# EasyEDA schematic SCH.json
TITLE: 8 Bit R-2R DAC; REV: 1.0; Date: 2023-07-31; Sheet: 1/1; Drawn By: Ella Pash
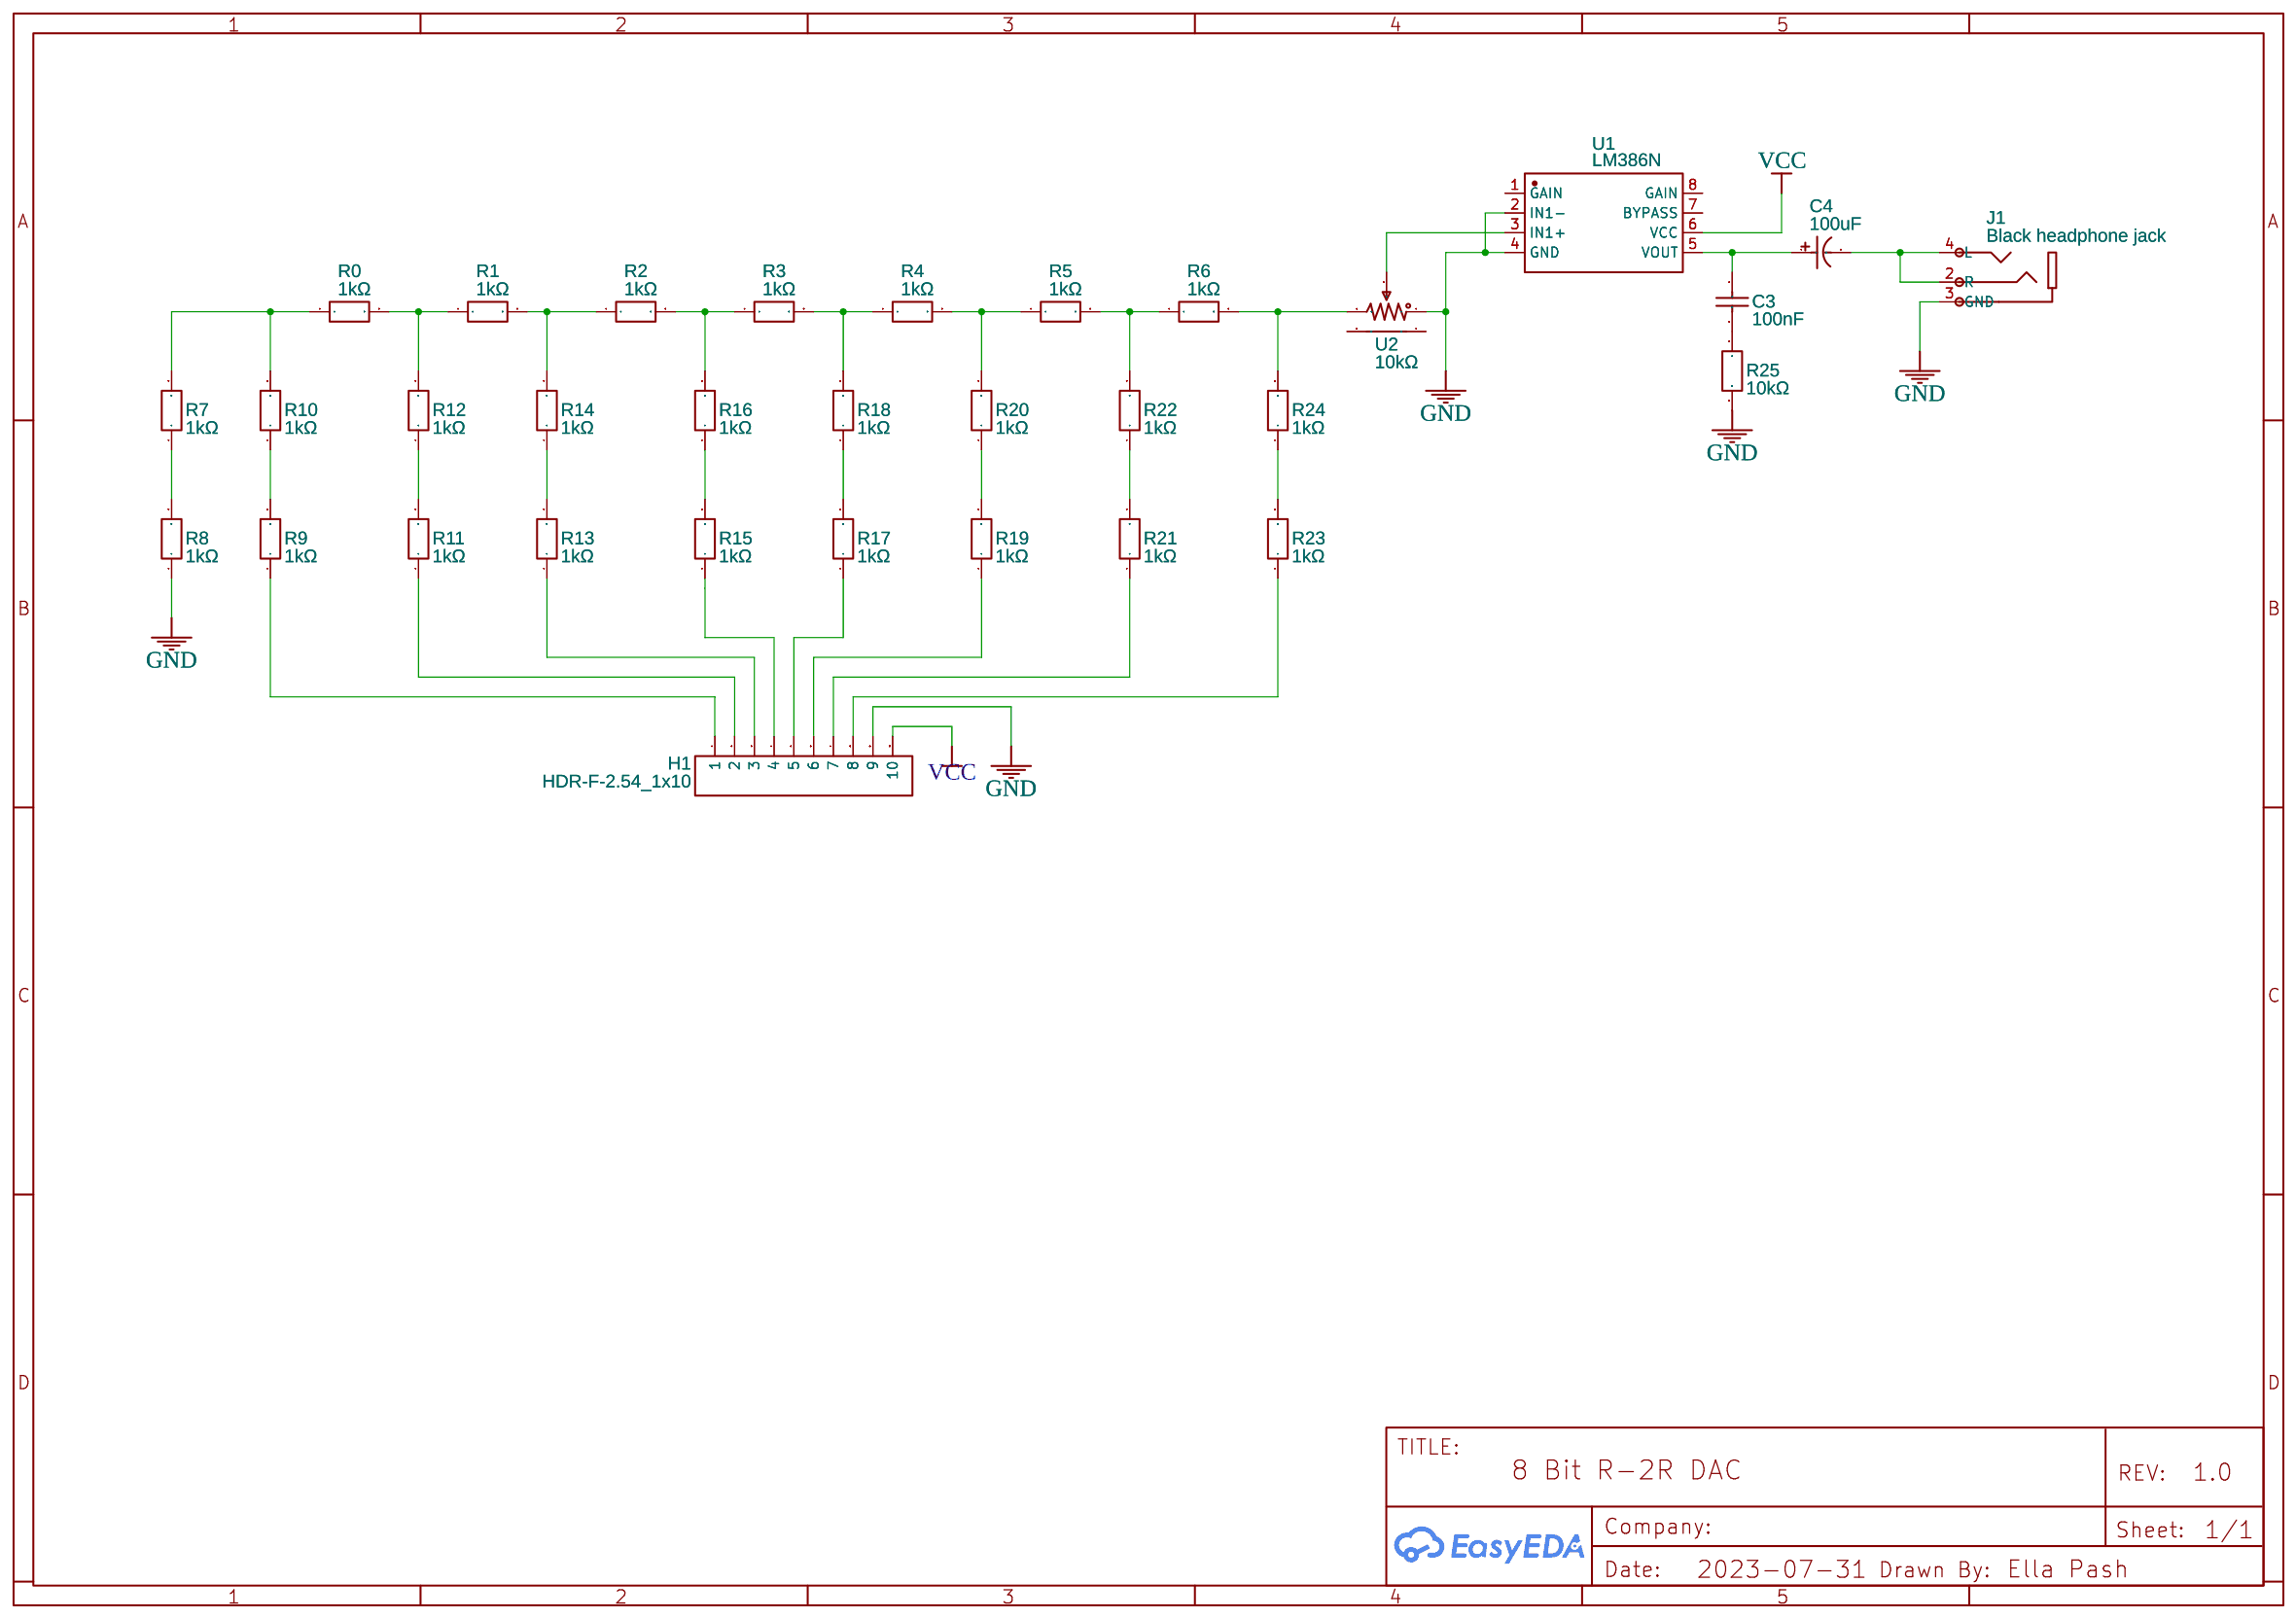
[diagram p0: schematic sheet]

## Parts
C3  100nF  [CAP-TH_L5.0-W3.2-P5.00-D0.5]
C4  100uF  [CAP-TH_BD5.0-P2.00-D0.8-FD]
H1  HDR-F-2.54_1x10  [HDR-F-2.54_1X10]
J1  Black headphone jack  [AUDIO-TH_PJ-3200]
R0  1kΩ  [RES-TH_BD2.3-L6.5-P10.50-D0.5]
R1  1kΩ  [RES-TH_BD2.3-L6.5-P10.50-D0.5]
R2  1kΩ  [RES-TH_BD2.3-L6.5-P10.50-D0.5]
R3  1kΩ  [RES-TH_BD2.3-L6.5-P10.50-D0.5]
R4  1kΩ  [RES-TH_BD2.3-L6.5-P10.50-D0.5]
R5  1kΩ  [RES-TH_BD2.3-L6.5-P10.50-D0.5]
R6  1kΩ  [RES-TH_BD2.3-L6.5-P10.50-D0.5]
R7  1kΩ  [RES-TH_BD2.3-L6.5-P10.50-D0.5]
R8  1kΩ  [RES-TH_BD2.3-L6.5-P10.50-D0.5]
R9  1kΩ  [RES-TH_BD2.3-L6.5-P10.50-D0.5]
R10  1kΩ  [RES-TH_BD2.3-L6.5-P10.50-D0.5]
R11  1kΩ  [RES-TH_BD2.3-L6.5-P10.50-D0.5]
R12  1kΩ  [RES-TH_BD2.3-L6.5-P10.50-D0.5]
R13  1kΩ  [RES-TH_BD2.3-L6.5-P10.50-D0.5]
R14  1kΩ  [RES-TH_BD2.3-L6.5-P10.50-D0.5]
R15  1kΩ  [RES-TH_BD2.3-L6.5-P10.50-D0.5]
R16  1kΩ  [RES-TH_BD2.3-L6.5-P10.50-D0.5]
R17  1kΩ  [RES-TH_BD2.3-L6.5-P10.50-D0.5]
R18  1kΩ  [RES-TH_BD2.3-L6.5-P10.50-D0.5]
R19  1kΩ  [RES-TH_BD2.3-L6.5-P10.50-D0.5]
R20  1kΩ  [RES-TH_BD2.3-L6.5-P10.50-D0.5]
R21  1kΩ  [RES-TH_BD2.3-L6.5-P10.50-D0.5]
R22  1kΩ  [RES-TH_BD2.3-L6.5-P10.50-D0.5]
R23  1kΩ  [RES-TH_BD2.3-L6.5-P10.50-D0.5]
R24  1kΩ  [RES-TH_BD2.3-L6.5-P10.50-D0.5]
R25  10kΩ  [RES-TH_BD2.4-L6.3-P10.30-D0.6]
U1  LM386N  [DIP-8_L9.7-W6.4-P2.54-LS7.6-BL]
U2  10kΩ  [RES-TH_RK09D1130C2P]

## Library data of the parts
C3 = K104K20X7RH53H5: Contributor: LCSC; Supplier: LCSC; Supplier Part: C1620208; Manufacturer: VISHAY(威世); JLCPCB Part Class: Extended Part; link: https://lcsc.com/eda_search?q=C1620208&%26type=1&ref=editor
C4 = 100uF 25V 5*11: Supplier: LCSC; Manufacturer: CX(承兴); Manufacturer Part: KM107M025D11RR0VH2FP0; Supplier Part: C47873; JLCPCB Part Class: Extended Part; link: https://lcsc.com/eda_search?q=C47873&%26type=1&ref=editor
H1 = HDR-F-2.54_1x10: Supplier Part: C35445; Supplier: LCSC; Contributor: LCEDA_Lib
J1 = Black headphone jack: Supplier: LCSC; Manufacturer: BOOMELE(博穆精密); Manufacturer Part: 320B直插; Supplier Part: C18166; JLCPCB Part Class: Extended Part; link: https://lcsc.com/eda_search?q=C18166&%26type=1&ref=editor
R0-R24 = MF1/4W-1KΩ±1%T52: Contributor: LCSC; Supplier: LCSC; Supplier Part: C713997; Manufacturer: Huaxing Mechanical-Elec.; JLCPCB Part Class: Extended Part; link: https://lcsc.com/eda_search?q=C713997&%26type=1&ref=editor
R25 = RD 1/4W 10K J T/B A1: Contributor: LCSC; Supplier: LCSC; Supplier Part: C433778; Manufacturer: Tyohm(幸亚电阻); Manufacturer Part: RD1/4W10KJT/BA1; JLCPCB Part Class: Extended Part; link: https://lcsc.com/eda_search?q=C433778&%26type=1&ref=editor
U1 = LM386N: Contributor: LCSC; Supplier: LCSC; Supplier Part: C510561; Manufacturer: HTC; JLCPCB Part Class: Extended Part; link: https://lcsc.com/eda_search?q=C510561&%26type=1&ref=editor
U2 = RK09D1130C3C: Contributor: lcsc; Supplier: LCSC; Supplier Part: C470316; Manufacturer: ALPSALPINE(阿尔卑斯阿尔派); JLCPCB Part Class: Extended Part; link: https://lcsc.com/eda_search?q=C470316&%26type=1&ref=editor

## Nets
GND: H1.9 J1.3(GND) R8.1 R25.2 U1.2(IN1-) U1.4(GND) U2.1
VCC: H1.10 U1.6(VCC)
Net-(C3-1): C3.1 C4.1 U1.5(VOUT)
Net-(C3-2): C3.2 R25.1
Net-(C4-2): C4.2 J1.2(R) J1.4(L)
Net-(H1-1): H1.1 R9.1
Net-(H1-2): H1.2 R11.1
Net-(H1-3): H1.3 R13.1
Net-(H1-4): H1.4 R15.1
Net-(H1-5): H1.5 R17.1
Net-(H1-6): H1.6 R19.1
Net-(H1-7): H1.7 R21.1
Net-(H1-8): H1.8 R23.1
Net-(R0-1): R0.1 R7.2 R10.2
Net-(R0-2): R0.2 R1.1 R12.2
Net-(R1-2): R1.2 R2.1 R14.2
Net-(R2-2): R2.2 R3.1 R16.2
Net-(R3-2): R3.2 R4.1 R18.2
Net-(R4-2): R4.2 R5.1 R20.2
Net-(R5-2): R5.2 R6.1 R22.2
Net-(R6-2): R6.2 R24.2 U2.3
Net-(R7-1): R7.1 R8.2
Net-(R9-2): R9.2 R10.1
Net-(R11-2): R11.2 R12.1
Net-(R13-2): R13.2 R14.1
Net-(R15-2): R15.2 R16.1
Net-(R17-2): R17.2 R18.1
Net-(R19-2): R19.2 R20.1
Net-(R21-2): R21.2 R22.1
Net-(R23-2): R23.2 R24.1
Net-(U1-3): U1.3(IN1+) U2.2

Not connected (* = marked no-connect by the designer): U1 1(GAIN) 7(BYPASS) 8(GAIN); U2 4 5
